# EAGLE design LB_BIT_w12_wirelessTransmitter_v03(2_2)OHW (EAGLE 6.6.0)

## Sheet 1 of 2
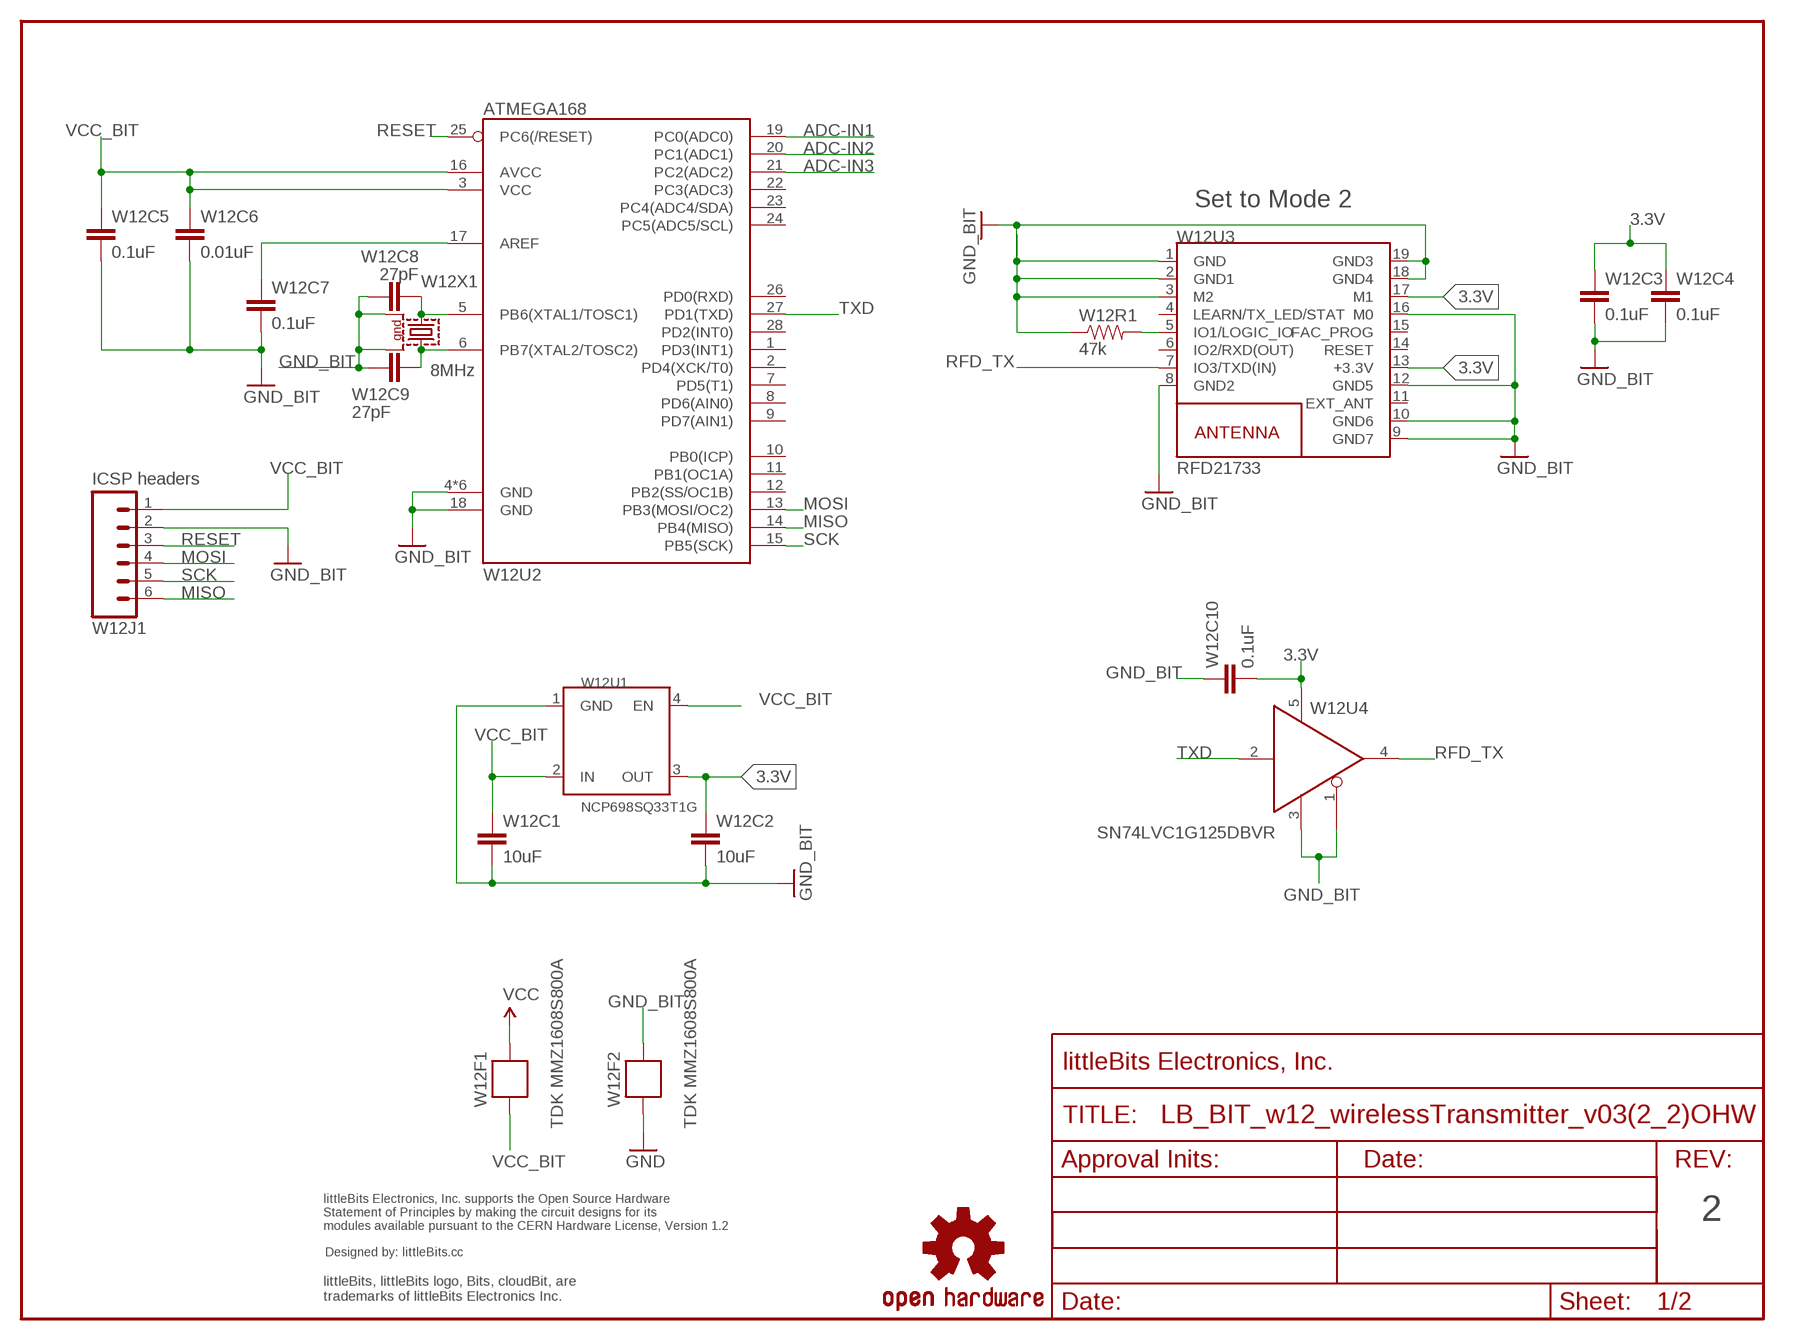
[diagram p0: schematic, sheet 1]

### Parts
FRAME1  FRAME-LETTER-OHWOHW  [FABDWG01-OHW]
U$15  OSHWCREDIT  [OSHWCREDIT]
U$31  OSHW-LOGOL  [OSHW-LOGO-L]
W12C1  10uF  CAPCAP-0603  [CAP-0603]
W12C2  10uF  CAPCAP-0603  [CAP-0603]
W12C3  0.1uF  CAP0603-CAP  [0603-CAP]
W12C4  0.1uF  CAP0603-CAP  [0603-CAP]
W12C5  0.1uF  CAP0603-CAP  [0603-CAP]
W12C6  0.01uF  CAP0603-CAP  [0603-CAP]
W12C7  0.1uF  CAP0603-CAP  [0603-CAP]
W12C8  27pF  CAPCAP-0603  [CAP-0603]
W12C9  27pF  CAPCAP-0603  [CAP-0603]
W12C10  0.1uF  CAP0603-CAP  [0603-CAP]
W12F1  TDK MMZ1608S800A  FERRITE-BEAD  [R0603]
W12F2  TDK MMZ1608S800A  FERRITE-BEAD  [R0603]
W12J1  ICSP headers  HRD-60.1INCH_NO_SILKSCREEN  [SIP6-SM-0.1IN-NOS.S.]
W12R1  47k  RESISTOR0603-RES  [0603-RES]
W12U1  NCP698SQ33T1G  NCP698  [NCP698_SC82-AB]
W12U2  ATMEGA168  ATMEGA168-28PINVFQFN-28  [VQFN28]
W12U3  RFD21733  RFD_CHIP  [RFD21733]
W12U4  SN74LVC1G125DBVR  5V_TO_3.3V_LEVEL-SHIFTERSOT23-5  [SOT23-5]
W12X1  8MHz  CRYSTAL-SMD-7B-SERIES-TXC  [CRYSTAL-SMD-7B-SERIES-5X3.2MM]

### Nets
3.3V: W12C2.1 W12C3.1 W12C4.1 W12C10.2 W12U1.3(OUT) W12U3.13(+3.3V) W12U3.17(M1) W12U4.5
ADC-IN1: W12U2.19(PC0(ADC0)) ; also sheet 2
ADC-IN2: W12U2.20(PC1(ADC1)) ; also sheet 2
ADC-IN3: W12U2.21(PC2(ADC2)) ; also sheet 2
GND: W12F2.2 ; also sheet 2
GND_BIT: W12C1.2 W12C2.2 W12C3.2 W12C4.2 W12C5.2 W12C6.2 W12C7.2 W12C8.1 W12C9.2 W12C10.1 W12F2.1 W12J1.2 W12R1.1 W12U1.1(GND) W12U2.4(GND) W12U2.18(GND) W12U2.TH(GND) W12U2.TH@1(GND) W12U2.TH@2(GND) W12U2.TH@3(GND) W12U2.TH@4(GND) W12U3.1(GND) W12U3.2(GND1) W12U3.3(M2) W12U3.8(GND2) W12U3.9(GND7) W12U3.10(GND6) W12U3.12(GND5) W12U3.16(M0) W12U3.18(GND4) W12U3.19(GND3) W12U4.1 W12U4.3 W12X1.P$2 W12X1.P$4
MISO: W12J1.6 W12U2.14(PB4(MISO))
MOSI: W12J1.4 W12U2.13(PB3(MOSI/OC2))
N$4: W12C7.1 W12U2.17(AREF)
N$6: W12R1.2 W12U3.5(IO1/LOGIC_IO)
N$8: W12C8.2 W12U2.5(PB6(XTAL1/TOSC1)) W12X1.P$1
N$9: W12C9.1 W12U2.6(PB7(XTAL2/TOSC2)) W12X1.P$3
RESET: W12J1.3 W12U2.25(PC6(/RESET))
RFD_TX: W12U3.7(IO3/TXD(IN)) W12U4.4
SCK: W12J1.5 W12U2.15(PB5(SCK))
TXD: W12U2.27(PD1(TXD)) W12U4.2
VCC: W12F1.1 ; also sheet 2
VCC_BIT: W12C1.1 W12C5.1 W12C6.1 W12F1.2 W12J1.1 W12U1.2(IN) W12U1.4(EN) W12U2.3(VCC) W12U2.16(AVCC)
Unconnected: W12U2.1(PD3(INT1)) W12U2.2(PD4(XCK/T0)) W12U2.7(PD5(T1)) W12U2.8(PD6(AIN0)) W12U2.9(PD7(AIN1)) W12U2.10(PB0(ICP)) W12U2.11(PB1(OC1A)) W12U2.12(PB2(SS/OC1B)) W12U2.22(PC3(ADC3)) W12U2.23(PC4(ADC4/SDA)) W12U2.24(PC5(ADC5/SCL)) W12U2.26(PD0(RXD)) W12U2.28(PD2(INT0)) W12U3.4(LEARN/TX_LED/STAT) W12U3.6(IO2/RXD(OUT)) W12U3.11(EXT_ANT) W12U3.14(RESET) W12U3.15(FAC_PROG)

### Notes on the sheet
- Set to Mode 2
- W12X1
- 8MHz
- 2

## Sheet 2 of 2
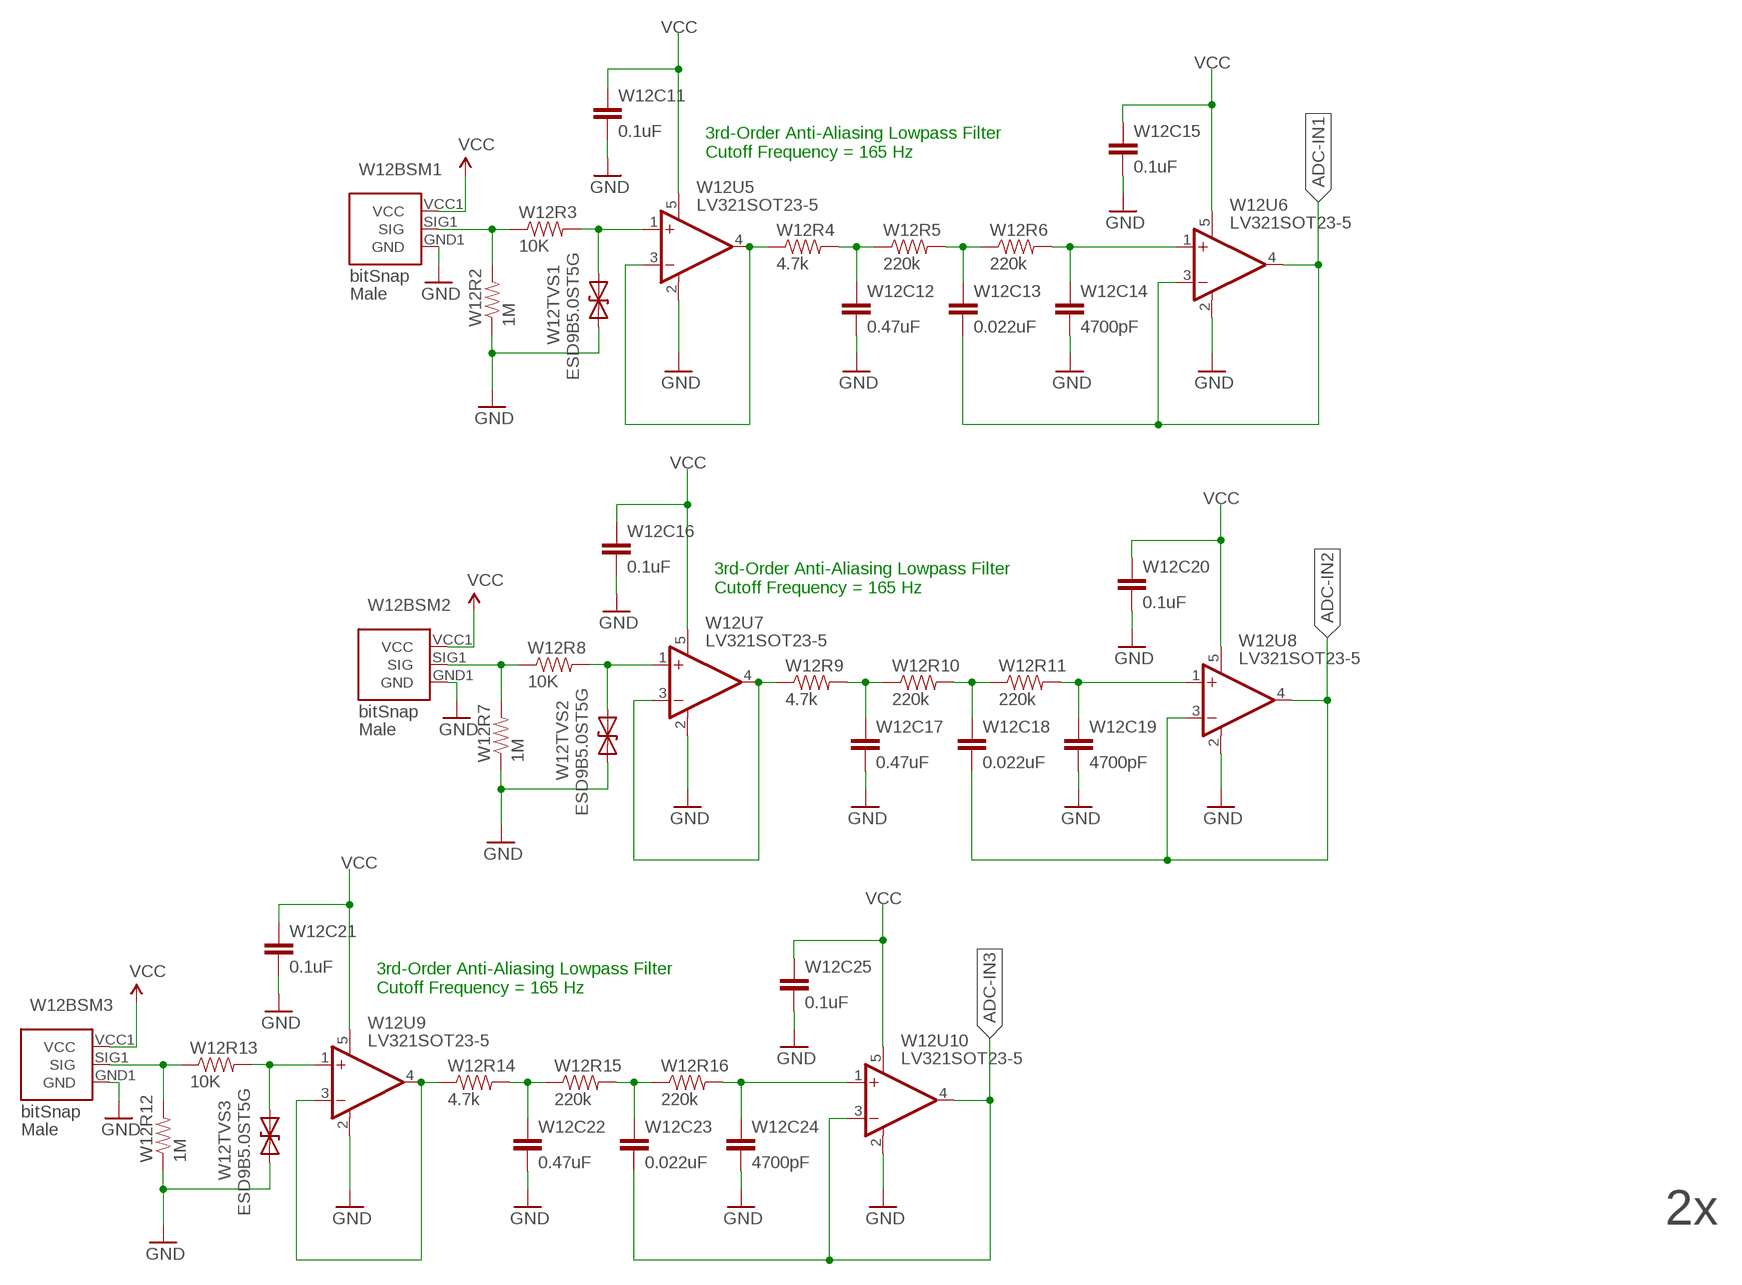
[diagram p1: schematic, sheet 2]

### Parts
W12BSM1  BITSNAP_V03_MALE  [BITSNAP_V03_MALE]
W12BSM2  BITSNAP_V03_MALE  [BITSNAP_V03_MALE]
W12BSM3  BITSNAP_V03_MALE  [BITSNAP_V03_MALE]
W12C11  0.1uF  CAP0603-CAP  [0603-CAP]
W12C12  0.47uF  CAPCAP-0603  [CAP-0603]
W12C13  0.022uF  CAPCAP-0603  [CAP-0603]
W12C14  4700pF  CAPCAP-0603  [CAP-0603]
W12C15  0.1uF  CAP0603-CAP  [0603-CAP]
W12C16  0.1uF  CAP0603-CAP  [0603-CAP]
W12C17  0.47uF  CAPCAP-0603  [CAP-0603]
W12C18  0.022uF  CAPCAP-0603  [CAP-0603]
W12C19  4700pF  CAPCAP-0603  [CAP-0603]
W12C20  0.1uF  CAP0603-CAP  [0603-CAP]
W12C21  0.1uF  CAP0603-CAP  [0603-CAP]
W12C22  0.47uF  CAPCAP-0603  [CAP-0603]
W12C23  0.022uF  CAPCAP-0603  [CAP-0603]
W12C24  4700pF  CAPCAP-0603  [CAP-0603]
W12C25  0.1uF  CAP0603-CAP  [0603-CAP]
W12R2  1M  RESISTOR0603-RES  [0603-RES]
W12R3  10K  RESISTOR0603-RES  [0603-RES]
W12R4  4.7k  RESISTOR0603  [RES-0603]
W12R5  220k  RESISTOR0603  [RES-0603]
W12R6  220k  RESISTOR0603  [RES-0603]
W12R7  1M  RESISTOR0603-RES  [0603-RES]
W12R8  10K  RESISTOR0603-RES  [0603-RES]
W12R9  4.7k  RESISTOR0603  [RES-0603]
W12R10  220k  RESISTOR0603  [RES-0603]
W12R11  220k  RESISTOR0603  [RES-0603]
W12R12  1M  RESISTOR0603-RES  [0603-RES]
W12R13  10K  RESISTOR0603-RES  [0603-RES]
W12R14  4.7k  RESISTOR0603  [RES-0603]
W12R15  220k  RESISTOR0603  [RES-0603]
W12R16  220k  RESISTOR0603  [RES-0603]
W12TVS1  ESD9B5.0ST5G  DIODE-TVSSOD-923  [SOD-923]
W12TVS2  ESD9B5.0ST5G  DIODE-TVSSOD-923  [SOD-923]
W12TVS3  ESD9B5.0ST5G  DIODE-TVSSOD-923  [SOD-923]
W12U5  LV321SOT23-5  [SOT23-5]
W12U6  LV321SOT23-5  [SOT23-5]
W12U7  LV321SOT23-5  [SOT23-5]
W12U8  LV321SOT23-5  [SOT23-5]
W12U9  LV321SOT23-5  [SOT23-5]
W12U10  LV321SOT23-5  [SOT23-5]

### Nets
ADC-IN1: W12C13.2 W12U6.3(-IN) W12U6.4(OUT) ; also sheet 1
ADC-IN2: W12C18.2 W12U8.3(-IN) W12U8.4(OUT) ; also sheet 1
ADC-IN3: W12C23.2 W12U10.3(-IN) W12U10.4(OUT) ; also sheet 1
GND: W12BSM1.GND1(GND) W12BSM2.GND1(GND) W12BSM3.GND1(GND) W12C11.2 W12C12.2 W12C14.2 W12C15.2 W12C16.2 W12C17.2 W12C19.2 W12C20.2 W12C21.2 W12C22.2 W12C24.2 W12C25.2 W12R2.1 W12R7.1 W12R12.1 W12TVS1.1(A) W12TVS2.1(A) W12TVS3.1(A) W12U5.2(V-) W12U6.2(V-) W12U7.2(V-) W12U8.2(V-) W12U9.2(V-) W12U10.2(V-) ; also sheet 1
N$20: W12R3.2 W12TVS1.2(C) W12U5.1(+IN)
N$21: W12C12.1 W12R4.2 W12R5.1
N$22: W12C14.1 W12R6.2 W12U6.1(+IN)
N$23: W12R4.1 W12U5.3(-IN) W12U5.4(OUT)
N$24: W12C13.1 W12R5.2 W12R6.1
N$25: W12R8.2 W12TVS2.2(C) W12U7.1(+IN)
N$26: W12C17.1 W12R9.2 W12R10.1
N$27: W12C19.1 W12R11.2 W12U8.1(+IN)
N$28: W12R9.1 W12U7.3(-IN) W12U7.4(OUT)
N$29: W12C18.1 W12R10.2 W12R11.1
N$30: W12R13.2 W12TVS3.2(C) W12U9.1(+IN)
N$31: W12C22.1 W12R14.2 W12R15.1
N$32: W12C24.1 W12R16.2 W12U10.1(+IN)
N$33: W12R14.1 W12U9.3(-IN) W12U9.4(OUT)
N$34: W12C23.1 W12R15.2 W12R16.1
SIG3: W12BSM1.SIG1(SIG) W12R2.2 W12R3.1
SIG4: W12BSM2.SIG1(SIG) W12R7.2 W12R8.1
SIG5: W12BSM3.SIG1(SIG) W12R12.2 W12R13.1
VCC: W12BSM1.VCC1(VCC) W12BSM2.VCC1(VCC) W12BSM3.VCC1(VCC) W12C11.1 W12C15.1 W12C16.1 W12C20.1 W12C21.1 W12C25.1 W12U5.5(V+) W12U6.5(V+) W12U7.5(V+) W12U8.5(V+) W12U9.5(V+) W12U10.5(V+) ; also sheet 1

### Notes on the sheet
- 3rd-Order Anti-Aliasing Lowpass Filter
  Cutoff Frequency = 165 Hz
- 3rd-Order Anti-Aliasing Lowpass Filter
  Cutoff Frequency = 165 Hz
- 3rd-Order Anti-Aliasing Lowpass Filter
  Cutoff Frequency = 165 Hz
- 2x

## Library data of the parts
FRAME1 = LITTLEBITS:FRAME-LETTER-OHW
U$15 = LITTLEBITS:OSHWCREDIT
U$31 = LITTLEBITS:OSHW-LOGO: Open Source Hardware Logo This logo indicates the piece of hardware it is found on incorporates a OSHW license and/or adheres to the definition of open source hardware found here: http://freedomdefined.org/OSHW
W12BSM1-W12BSM3 = bitSnap:BITSNAP_V03_MALE
W12C1 W12C2 W12C8 W12C9 W12C12-W12C14 W12C17-W12C19 W12C22-W12C24 = LITTLEBITS:CAP
W12C3-W12C7 W12C10 W12C11 W12C15 W12C16 W12C20 W12C21 W12C25 = SparkFun:CAP: Capacitor Standard 0603 ceramic capacitor, and 0.1" leaded capacitor.
W12F1 W12F2 = LITTLEBITS:FERRITE-BEAD
W12J1 = LITTLEBITS:HRD-6
W12R1-W12R3 W12R7 W12R8 W12R12 W12R13 = SparkFun:RESISTOR: Resistor Basic schematic elements and footprints for 0603, 1206, and PTH resistors.
W12R4-W12R6 W12R9-W12R11 W12R14-W12R16 = LITTLEBITS:RESISTOR
W12TVS1-W12TVS3 = LITTLEBITS:DIODE-TVS: Bidirectional Transient Voltage Suppression Diode: Device conducts in avalanche mode after reaching a part dependent voltage threshold. Used for limiting voltage spikes on ESD sensitive inputs and outputs.; IEC_ESD_PROT0: +/-18kV; LB_PN: ?; MPN: ESD9B5.0ST5G; V_CLAMP: ?; V_OPERATION: 5V
W12U1 = LITTLEBITS:NCP698
W12U2 = LITTLEBITS:ATMEGA168-28PIN
W12U3 = LITTLEBITS:RFD_CHIP
W12U4 = LITTLEBITS:5V_TO_3.3V_LEVEL-SHIFTER: SN74LVC1G125
W12U5-W12U10 = LITTLEBITS:LV321
W12X1 = LITTLEBITS:CRYSTAL-SMD-7B-SERIES-TXC; MFG: TXC; MPN: 7B SERIES

## Board
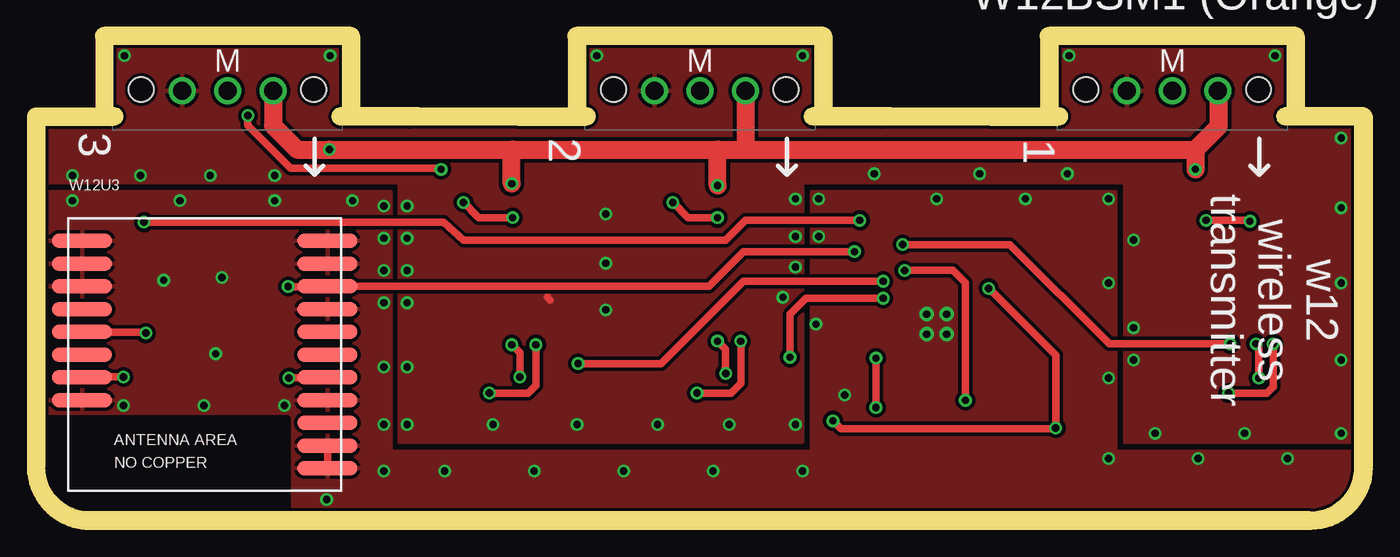
[diagram p2: board, top side]
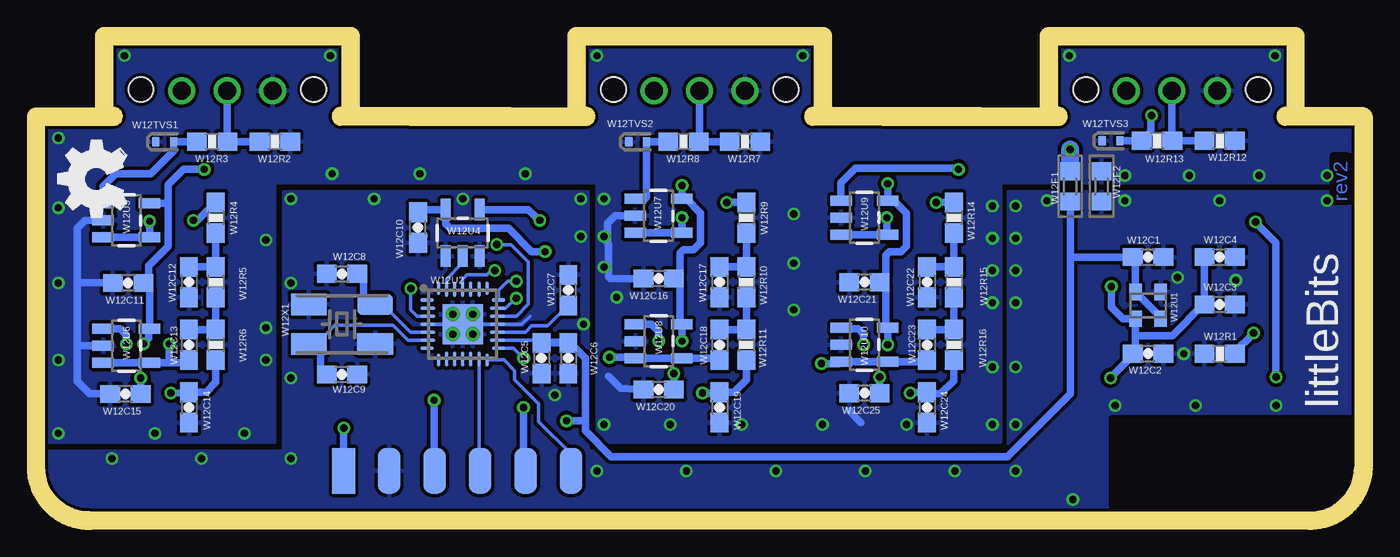
[diagram p3: board, bottom side, seen from below]

Size 73.2 x 26.1 mm. Coordinates in mm from the lower left corner, seen from the top.
Outline: 73.2,21.6 73.2,2.5 arc-90 70.7,0 2.5,0 arc-90 0,2.5 0,21.6
Outline: 52.8,21.6 46.8,21.6
Outline: 26.4,21.6 20.35,21.6
Copper layers (1*16): Top 0.035mm / dielectric 1.5mm / Bottom 0.035mm
Design rules "littleBitsDRC": minimum track width 0.2mm, minimum drill 0.4mm, track to track 0.2mm, track to pad 0.2mm, pad to pad 0.2mm, via to via 0.2mm, smd to smd 0mil, copper to edge 0.2mm, drill to drill 0.2mm, minimum pad ring 0.2mm, minimum via ring 0.15mm, stop-mask expansion 0.1mm, vias tented up to drill 0mil, thermal gap 0.2mm
tRestrict: area 0.2,0.4 to 13.6,5.2
bRestrict: area 0.2,0.4 to 13.6,5.2
Milling: 7 lines

### Footprints (pad centres in the part's own frame; a part is rotated, then mirrored left to right if it is on the bottom)
BITSNAP_V03_MALE = drill 1: GND1 8.98,2.56; SIG1 6.44,2.56; VCC1 3.9,2.56 | hole 1.4: 11.27,2.5; 1.63,2.5
CAP-0603 = smd 1.1 x 1: 1 -0.85,0; 2 0.85,0
0603-CAP = smd 1.1 x 1: 1 -0.85,0; 2 0.85,0
R0603 = smd 1 x 1.1: 1 -0.85,0; 2 0.85,0
SIP6-SM-0.1IN-NOS.S. = smd 1.27 x 2.54: 1 -6.35,0; 2 -3.81,0; 3 -1.27,0; 4 1.27,0; 5 3.81,0; 6 6.35,0
0603-RES = smd 1.1 x 1: 1 -0.85,0; 2 0.85,0
RES-0603 = smd 1.1 x 1: 1 -0.85,0; 2 0.85,0
SOD-923 = smd 0.4 x 0.5: 1 -0.5,0; 2 0.5,0
NCP698_SC82-AB = smd 0.7 x 0.9: 1 -0.7,-0.7; 2 0.7,-0.7; 3 0.7,0.8; 4 -0.7,0.8
VQFN28 = smd 0.75 x 0.2: 1 -2,1.35; 7 -2,-1.35; 15 2,-1.35; 21 2,1.35 | smd 0.85 x 0.2: 2 -1.95,0.9; 3 -1.95,0.455; 4 -1.95,0; 5 -1.95,-0.45; 6 -1.95,-0.9; 16 1.95,-0.9; 17 1.95,-0.45; 18 1.95,0; 19 1.95,0.45; 20 1.95,0.9 | smd 0.2 x 0.75: 8 -1.35,-2; 14 1.35,-2; 22 1.35,2; 28 -1.35,2 | smd 0.2 x 0.85: 9 -0.9,-1.95; 10 -0.45,-1.95; 11 0,-1.95; 12 0.45,-1.95; 13 0.9,-1.95; 23 0.9,1.95; 24 0.45,1.95; 25 0,1.95; 26 -0.45,1.95; 27 -0.9,1.95 | smd 2.25 x 2.25: TH 0,0 | drill 0.406 pad 0.406: TH@1 -0.559,0.559; TH@2 0.559,0.559; TH@3 -0.559,-0.559; TH@4 0.559,-0.559
RFD21733 = smd 3.353 x 0.813: 1 -6.858,6.35; 2 -6.858,5.08; 3 -6.858,3.81; 4 -6.858,2.54; 5 -6.858,1.27; 6 -6.858,0; 7 -6.858,-1.27; 8 -6.858,-2.54; 9 6.858,-6.35; 10 6.858,-5.08; 11 6.858,-3.81; 12 6.858,-2.54; 13 6.858,-1.27; 14 6.858,0; 15 6.858,1.27; 16 6.858,2.54; 17 6.858,3.81; 18 6.858,5.08; 19 6.858,6.35
SOT23-5 = smd 0.55 x 1.2: 1 -0.95,-1.3; 2 0,-1.3; 3 0.95,-1.3; 4 0.95,1.3; 5 -0.95,1.3
CRYSTAL-SMD-7B-SERIES-5X3.2MM = smd 2 x 1.2: P$1 -1.85,-1.1; P$2 1.85,-1.1; P$3 1.85,1.1; P$4 -1.85,1.1

### Placement (x,y rotation side)
FRAME1  27.35,-10.05 0 top  (outside the outline)
U$15  -60.55,-75.96 0 top  (outside the outline)
U$21  [OSHW_FILLX150_NOTEXT]  68.63,15.65 0 top
U$31  3.05,-81.35 0 top  (outside the outline)
W12BSM1  69.45,26.1 180 top
W12BSM2  43.05,26.1 180 top
W12BSM3  16.65,26.1 180 top
W12C1  11.54,14.24 0 bottom
W12C2  11.54,8.84 0 bottom
W12C3  7.54,11.59 0 bottom
W12C4  7.54,14.24 0 bottom
W12C5  45.44,8.59 270 bottom
W12C6  43.94,8.59 270 bottom
W12C7  43.94,12.39 90 bottom
W12C8  56.59,13.3 0 bottom
W12C9  56.59,7.68 0 bottom
W12C10  52.34,15.89 90 bottom
W12C11  68.54,12.79 180 bottom
W12C12  65.14,12.84 270 bottom
W12C13  65.14,9.34 270 bottom
W12C14  65.14,5.84 270 bottom
W12C15  68.69,6.59 180 bottom
W12C16  38.89,13.04 180 bottom
W12C17  35.49,12.84 270 bottom
W12C18  35.49,9.34 270 bottom
W12C19  35.49,5.84 270 bottom
W12C20  38.89,6.84 180 bottom
W12C21  27.39,12.84 180 bottom
W12C22  23.89,12.84 270 bottom
W12C23  23.89,9.34 270 bottom
W12C24  23.89,5.84 270 bottom
W12C25  27.39,6.64 180 bottom
W12F1  15.89,18.19 270 bottom
W12F2  14.14,18.19 90 bottom
W12J1  50.14,2.29 0 bottom
W12R1  7.54,8.84 0 bottom
W12R2  60.34,20.69 180 bottom
W12R3  63.84,20.69 180 bottom
W12R4  63.64,16.44 270 bottom
W12R5  63.64,12.84 270 bottom
W12R6  63.64,9.34 270 bottom
W12R7  34.07,20.69 180 bottom
W12R8  37.5,20.69 180 bottom
W12R9  33.99,16.44 270 bottom
W12R10  33.99,12.84 270 bottom
W12R11  33.99,9.34 270 bottom
W12R12  7.54,20.74 180 bottom
W12R13  11.04,20.74 180 bottom
W12R14  22.39,16.44 270 bottom
W12R15  22.39,12.84 270 bottom
W12R16  22.39,9.34 270 bottom
W12TVS1  66.49,20.69 0 bottom
W12TVS2  40.06,20.69 0 bottom
W12TVS3  13.61,20.74 0 bottom
W12U1  11.54,11.59 180 bottom
W12U2  49.84,10.49 0 bottom
W12U3  8.93,8.79 0 top
W12U4  49.84,15.59 0 bottom
W12U5  68.64,16.29 270 bottom
W12U6  68.64,9.29 270 bottom
W12U7  38.9,16.54 270 bottom
W12U8  38.89,9.54 270 bottom
W12U9  27.39,16.44 270 bottom
W12U10  27.39,9.34 270 bottom
W12X1  56.59,10.49 180 bottom

### Tracks (layer width: path | path; a pad name or v marks a point on that pad's centre or on a via)
3.3V  (via drill 0.41)
  Top 0.406: v13.64,7.49 14.44,7.49 14.54,7.59 W12U3.13 15.81,7.54 | v45.24,14.54 39.04,14.54 37.1,12.6 W12U3.17 14.5,12.6 14.49,12.59 v13.59,12.59
  Bottom 0.406: W12C4.1 W12C3.1 8.44,11.59 10.19,9.84 12.24,9.84 | 12.24,9.84 W12U1.3 12.95,10.8 13.59,11.44 v13.59,12.59 | 12.24,9.84 12.24,9.09 W12C2.1 12.39,8.74 v13.64,7.49 | 50.74,16.64 50.74,17.14 W12U4.5 | W12U4.5 52.19,16.89 W12C10.2 | v45.24,14.54 45.99,14.54 47.29,15.84 50.54,15.84 50.79,16.09 W12U4.5
ADC-IN1  (via drill 0.41)
  Top 0.406: v47.94,14.94 53.94,14.94 59.49,9.39 v66.24,9.39
  Bottom 0.203: v47.94,14.94 47.14,14.94 46.19,13.99 46.19,11.59 46.84,10.94 W12U2.19
  Bottom 0.406: W12U6.3 W12U6.4 66.34,8.34 | 66.34,8.34 65.24,8.34 W12C13.2 | v66.24,9.39 66.24,8.44 66.34,8.34
ADC-IN2  (via drill 0.41)
  Top 0.406: v46.85,11.94 42.54,11.94 41.64,11.04 v41.64,8.64
  Bottom 0.203: 40.74,8.64 40.24,8.64 | W12U2.20 47.44,11.39 v46.85,11.94
  Bottom 0.406: 35.59,8.64 W12C18.2 35.59,8.59 W12U8.4 W12U8.3 40.24,8.64 v41.64,8.64
ADC-IN3  (via drill 0.41)
  Top 0.406: v46.85,12.89 39.04,12.89 34.44,8.29 v29.79,8.29
  Bottom 0.203: 28.74,8.34 W12U10.3 | v46.85,12.89 47.34,12.89 47.84,12.39 W12U2.21
  Bottom 0.406: W12C23.2 23.99,8.39 W12U10.4 W12U10.3 28.79,8.29 v29.79,8.29
GND  (via drill 0.41)
  Top 0.406: 28.09,11.99 28.24,11.84
  Bottom 0.406: 28.29,6.51 W12C25.2 | 27.59,4.99 28.24,5.64 | W12C20.2 41.01,6.91 41.69,7.59 | W12C16.2 41.59,13.04 41.69,13.14 41.69,14.99 41.74,15.04 41.74,16.14 41.34,16.54 W12U7.2 | W12C15.2 70.69,6.59 71.39,7.29 71.39,9.19 | 71.39,9.19 71.39,12.69 | 71.39,12.69 71.39,15.84 70.94,16.29 W12U5.2 | W12C11.2 71.29,12.79 71.39,12.69 | W12U6.2 71.29,9.29 71.39,9.19
  other vias: 31.34,13.89 31.34,11.29 31.34,16.64 20.24,17.09 20.24,15.29 20.24,13.49 20.24,11.69 41.94,15.39 41.94,17.49 41.94,13.69 41.24,11.99 20.24,4.89 20.24,8.09 41.94,4.89 25.04,4.89 29.74,4.89 34.24,4.89 38.24,4.89 12.84,18.79 1.54,18.79 5.34,18.79 4.44,25.49 15.94,25.49 30.84,25.49 42.34,25.49 57.24,25.49 68.74,25.49 46.34,18.89 52.24,18.89 57.14,18.89 60.84,15.19 60.84,10.29 60.84,8.49 62.04,4.39 67.04,4.39 72.44,4.39 72.44,20.89 72.44,8.49 72.44,16.99 9.24,18.79 72.44,12.79
  pour Top: -0.06,18.39 19.79,18.39 19.79,3.89 42.34,3.89 42.34,18.39 60.34,18.39 60.34,3.89 73.34,3.89 73.34,26.69 -0.06,26.69
  pour Bottom: -0.06,26.69 73.34,26.69 73.34,3.89 60.34,3.89 60.34,18.39 42.34,18.39 42.34,3.89 19.79,3.89 19.79,18.39 0.04,18.39
GND_BIT  (via drill 0.41)
  Top 0.406: W12U3.9 W12U3.10
  Bottom 0.203: 50.96,10.49 W12U2.TH@3 | W12U2.TH W12U2.TH@4 48.72,10.49 | W12U2.4 48.72,10.49 | 46.09,10.94 46.54,10.49 W12U2.18 48.72,10.49
  Bottom 0.406: 51.99,15.39 W12C10.1 | W12C9.2 55.44,7.74 | 55.44,9.39 W12X1.P$4 | W12C8.1 57.74,13.24 57.79,13.19 | 57.79,11.64 57.84,11.59 W12X1.P$2
  other vias: 1.54,17.39 43.24,17.49 12.84,17.39 17.19,17.39 13.39,5.94 49.84,17.49 59.44,17.49 54.79,17.49 59.44,12.79 59.44,7.49 59.44,2.99 44.69,6.54 43.09,10.49 42.34,2.29 7.54,17.39 6.64,12.94 9.54,8.84 9.89,13.09 4.39,5.94 8.89,5.94 37.34,2.29 32.34,2.29 27.34,2.29 22.34,2.29 18.94,4.89 18.94,2.29 18.94,11.69 18.94,13.49 18.94,15.29 18.94,17.09 43.24,15.39 64.44,2.99 69.44,2.99 18.94,8.09 15.74,0.69
  pour Top (no thermals): 48.79,11.54 48.79,9.49 50.89,9.49 50.89,11.49
  pour Bottom: -0.11,17.89 19.34,17.89 19.34,3.39 42.84,3.39 42.84,17.89 59.84,17.89 59.84,3.39 73.24,3.39 73.19,-0.06 -0.11,-0.11
  pour Top: -0.06,-0.01 -0.06,17.89 19.34,17.89 19.34,3.39 42.84,3.39 42.84,17.89 59.84,17.89 59.84,3.39 73.34,3.39 73.34,-0.01
MISO
  Bottom 0.203: W12J1.6 43.79,3.24 45.59,5.04 45.59,6.04 46.94,7.39 46.94,7.89 47.54,8.49 W12U2.14
MOSI
  Bottom 0.203: W12U2.13 48.94,2.36 W12J1.4
N$4
  Bottom 0.203: W12U2.17 46.34,10.04 45.99,10.39 45.09,10.39 W12C7.1
N$6  (via drill 0.41)
  Top 0.406: W12U3.5 2.09,10.04 5.64,10.04 v5.64,9.99
  Bottom 0.406: W12R1.2 6.74,8.84 6.74,8.89 v5.64,9.99
N$8
  Bottom 0.203: W12U2.5 52.74,10.04 53.89,11.19 54.34,11.19 W12X1.P$1
  Bottom 0.406: W12X1.P$1 55.44,11.59 55.44,11.94 55.39,11.94 55.39,12.89 W12C8.2
N$9
  Bottom 0.203: W12U2.6 52.89,9.59 53.74,10.44 56.99,10.44 57.79,9.59 57.94,9.59 58.24,9.59 W12X1.P$3 | 57.79,8.14 W12C9.1
  Bottom 0.406: 57.79,8.14 57.79,9.44 57.94,9.59
N$20
  Bottom 0.406: W12R3.2 W12TVS1.2 65.99,20.19 67.29,18.89 69.24,18.89 69.94,18.19 W12U5.1 | W12U5.1
N$21
  Bottom 0.406: W12R4.2 W12R5.1 W12C12.1
N$22  (via drill 0.41)
  Top 0.406: v68.64,9.39 68.64,6.99 68.29,6.64 v66.14,6.64
  Bottom 0.406: v66.14,6.64 W12C14.1 64.19,6.69 63.64,7.24 W12R6.2 | W12U6.1 68.99,10.24 68.64,9.89 v68.64,9.39
N$23  (via drill 0.41)
  Top 0.406: v67.34,16.24 67.29,16.29 v64.89,16.29
  Bottom 0.406: W12U5.4 W12U5.3 | 63.94,16.99 W12R4.1 64.64,16.29 v64.89,16.29 | v67.34,16.24 W12U5.4 | W12U5.4
N$24
  Bottom 0.406: W12R5.2 W12R6.1 W12C13.1
N$25
  Bottom 0.406: W12R8.2 W12TVS2.2 39.56,17.59 39.7,17.45 40.16,17.45 W12U7.1
N$26
  Bottom 0.406: W12C17.1 W12R10.1 W12R9.2
N$27  (via drill 0.41)
  Top 0.406: 38.94,9.49 v38.89,9.54 38.89,7.19 38.34,6.64 v36.44,6.64
  Bottom 0.406: 38.84,9.64 v38.89,9.54 38.89,10.09 39.29,10.49 W12U8.1 | W12R11.2 33.99,7.39 34.69,6.69 W12C19.1 35.54,6.64 v36.44,6.64
N$28  (via drill 0.41)
  Top 0.406: v37.59,16.44 35.94,16.44 v35.09,17.29
  Bottom 0.406: W12U7.3 W12U7.4 37.6,16.33 v37.59,16.44 | v35.09,17.29 W12R9.1
N$29
  Bottom 0.406: W12R10.2 W12R11.1 W12C18.1
N$30  (via drill 0.41)
  Top 0.406: v22.14,19.14 22.09,19.19 13.74,19.19 11.34,21.59 v11.34,22.14
  Bottom 0.406: W12R13.2 W12TVS3.2 | W12U9.1 28.69,18.39 27.89,19.19 22.19,19.19 v22.14,19.14 | 11.94,20.69 W12R13.2 | v11.34,22.14 11.39,22.14 11.39,21.24 W12R13.2 | 11.84,20.79 W12R13.2
N$31
  Bottom 0.406: W12R14.2 W12R15.1 W12C22.1
N$32  (via drill 0.41)
  Top 0.406: v27.44,9.34 27.44,7.09 26.99,6.64 v24.84,6.64
  Bottom 0.406: v24.84,6.64 24.82,6.66 W12C24.1 23.86,6.59 23.14,6.59 22.39,7.34 W12R16.2 | W12U10.1 28.64,10.24 27.74,10.24 27.44,9.94 v27.44,9.34
N$33  (via drill 0.41)
  Top 0.406: v26.14,16.44 24.24,16.44 v23.39,17.29
  Bottom 0.406: W12U9.3 W12U9.4 26.14,15.49 v26.14,16.44 | v23.39,17.29 W12R14.1
N$34
  Bottom 0.406: W12R15.2 W12R16.1 W12C23.1
RESET  (via drill 0.41)
  Top 0.406: v48.04,13.49 50.74,13.49 51.44,12.79 v51.44,6.24
  Bottom 0.203: 51.44,2.32 W12J1.3 | v48.04,13.49 48.24,13.49 48.49,13.24 49.59,13.24 49.84,12.99 W12U2.25
  Bottom 0.406: v51.44,6.24 51.44,2.32
RFD_TX  (via drill 0.41)
  Top 0.406: v5.54,16.19 22.29,16.19 23.39,15.19 38.04,15.19 39.14,16.29 v45.54,16.29 | W12U3.7 3.37,7.52 3.39,7.54 v4.39,7.54
  Bottom 0.406: W12U4.4 46.19,16.89 v45.54,16.29 | v4.39,7.54 4.39,15.04 v5.54,16.19
SCK  (via drill 0.41)
  Top 0.406: v46.44,8.59 v46.44,5.84
  Bottom 0.203: 46.29,2.33 W12J1.5 46.44,2.4 | W12U2.15 46.99,9.14 v46.44,8.59
  Bottom 0.406: v46.44,5.84 46.44,2.4
SIG3
  Bottom 0.406: W12R2.2 W12R3.1 | W12BSM1.SIG1 63.01,20.71
  Bottom 1.016: 63.01,20.71 W12R3.1
SIG4
  Bottom 0.406: W12BSM2.SIG1 36.61,20.73 | W12R8.1 W12R7.2
  Bottom 1.016: 36.61,20.73 W12R8.1
SIG5
  Bottom 0.406: W12BSM3.SIG1 10.21,20.76 W12R13.1 W12R12.2
TXD
  Bottom 0.203: W12U4.2 49.89,13.89 50.74,12.99 W12U2.27
VCC  (via drill 0.41)
  Top 0.406: v26.54,7.54 26.54,8.89 v26.09,9.34 | v38.04,7.74 38.04,9.09 v37.59,9.54 | 26.09,20.19 26.14,20.24 | 37.59,20.19 37.64,20.24 | v67.84,7.49 67.84,9.24 v67.69,9.39
  Top 1.016: W12BSM3.VCC1 12.75,21.58 14.09,20.24 v15.89,20.24 26.14,20.24 37.64,20.24 39.04,20.24 | 39.04,20.24 64.29,20.24 | 64.29,20.24 65.59,21.54 65.59,23.5 W12BSM1.VCC1 | v26.09,18.34 26.09,20.19 | v37.59,18.24 37.59,20.19 | W12BSM2.VCC1 39.15,20.35 39.04,20.24 | 64.29,20.24 v64.29,19.14
  Bottom 0.406: W12C25.1 v26.54,7.54 | v26.09,9.34 W12U10.5 26.19,10.39 26.19,12.64 26.39,12.84 W12C21.1 26.19,13.19 26.19,14.34 25.99,14.54 25.34,14.54 25.04,14.84 25.04,16.69 25.74,17.39 W12U9.5 v26.09,18.34 | v26.09,9.34 | W12C20.1 v38.04,7.74 | v37.59,9.54 W12U8.5 | W12U8.5 | 67.39,12.49 67.34,12.44 W12U6.5 67.39,10.19 67.39,9.69 v67.69,9.39 | 67.39,12.49 W12C11.1 67.69,12.84 | W12C15.1 v67.84,7.49 | 67.29,17.19 W12U5.5 66.29,17.24 | v26.09,18.34 | v37.59,18.24 v37.6,18.23 W12U7.5 37.34,17.49 36.54,16.69 36.54,15.04 36.94,14.64 37.49,14.64 37.69,14.44 37.69,13.39 W12C16.1 | W12C16.1 37.99,13.04 37.69,12.74 37.69,10.59 W12U8.5 | 37.74,13.34 W12C16.1 | v64.29,19.14 65.44,19.14 66.29,18.29 66.29,17.24 | 66.29,17.24 66.29,14.84 67.39,13.74 67.39,12.49
  Bottom 1.016: W12F1.1 v15.89,20.24
VCC_BIT  (via drill 0.41)
  Top 0.406: v52.74,12.49 56.49,8.74 v56.49,4.69 56.44,4.64 44.49,4.64 v44.04,5.09
  Bottom 0.203: 45.61,9.61 W12C5.1 45.59,9.59 W12U2.16 43.79,9.59 | v52.74,12.49 52.74,11.29 52.39,10.94 W12U2.3
  Bottom 0.406: W12U1.4 10.84,10.89 W12U1.2 12.24,14.19 W12C1.1 15.84,14.24 15.89,14.19 | W12C6.1 W12C5.1 | W12C6.1 43.94,9.49 | W12J1.1 v56.49,4.69 | 43.79,9.59 43.79,9.44 | W12F1.2 15.89,14.19 | 15.89,14.19 15.89,6.59 19.39,3.09 41.54,3.09 42.99,4.54 42.99,5.09 | W12C6.1 43.84,9.44 42.99,8.59 42.99,5.09 | v44.04,5.09 42.99,5.09

### Text on the board
Bottom: rev2
tPlace: 3 | 2 | 1 | w12 / wireless / transmitter
bPlace: littleBits
tNames: W12BSM2 (Orange) | W12BSM3 (Orange) | W12BSM1 (Orange)
Milling: 1mm DIA. ROUTER PATH
Measures: C.L.
dxf: 2 | Wireless Radio Transmitter Bit